# EAGLE design working (EAGLE 9.5.1)
AUTHOR: siddacious
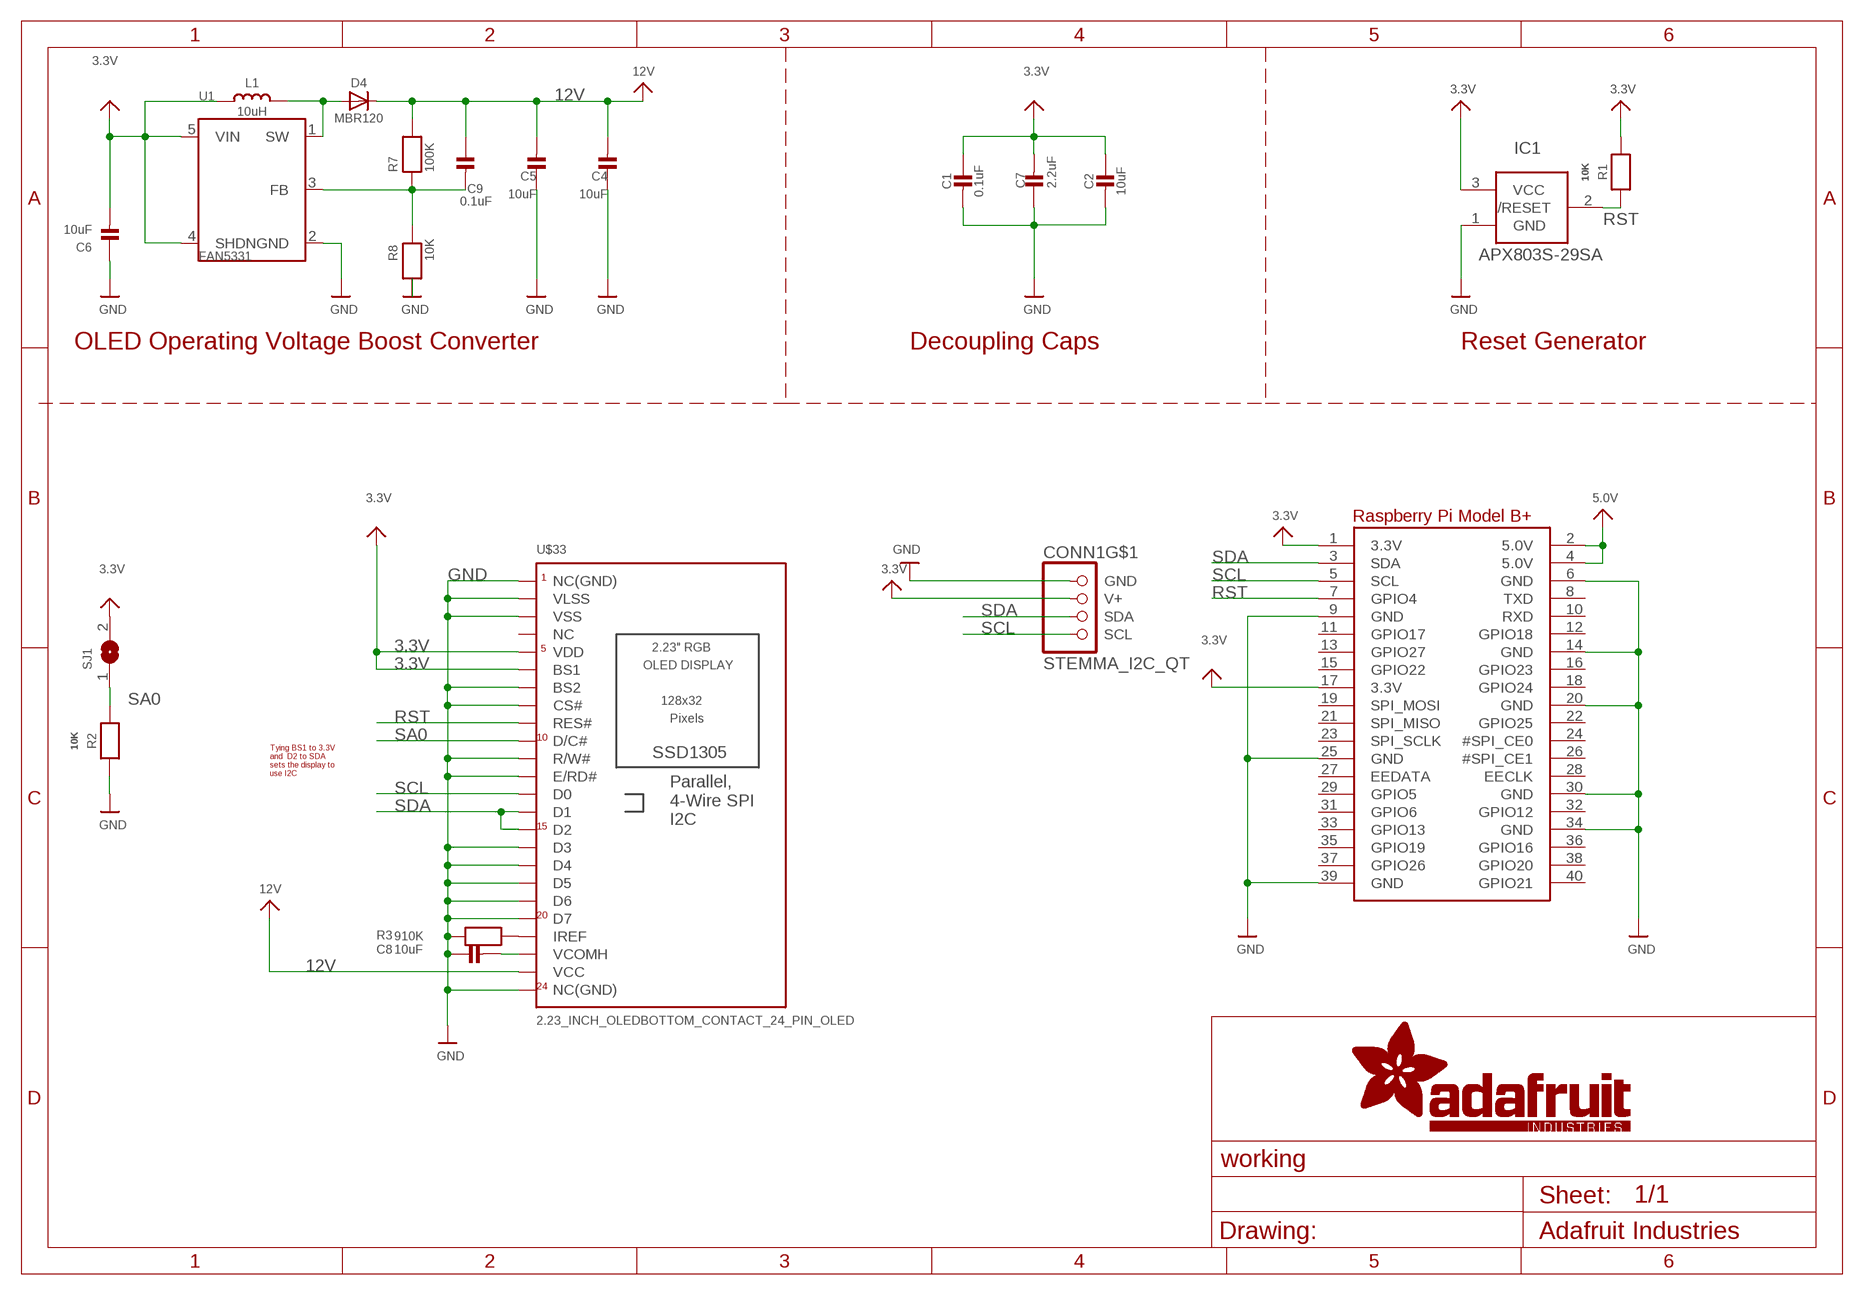
[diagram p0: schematic, sheet 1]

## Parts
C1  0.1uF  CAP_CERAMIC0603_NO  [0603-NO]
C2  10uF  CAP_CERAMIC0805-NOOUTLINE  [0805-NO]
C4  10uF  CAP_CERAMIC0805-NOOUTLINE  [0805-NO]
C5  10uF  CAP_CERAMIC0805-NOOUTLINE  [0805-NO]
C6  10uF  CAP_CERAMIC0805-NOOUTLINE  [0805-NO]
C7  2.2uF  CAP_CERAMIC0805-NOOUTLINE  [0805-NO]
C8  10uF  CAP_CERAMIC0805-NOOUTLINE  [0805-NO]
C9  0.1uF  CAP_CERAMIC0603_NO  [0603-NO]
CONN1  STEMMA_I2C_QT  [JST_SH4]
D4  MBR120  DIODESOD-123  [SOD-123]
IC1  APX803S-29SA  AXP083-SAG  [SOT23]
L1  10uH  INDUCTOR  [INDUCTOR_1007]
R1  10K  RESISTOR_0603_NOOUT  [0603-NO]
R2  10K  RESISTOR_0603_NOOUT  [0603-NO]
R3  910K  RESISTOR0805_NOOUTLINE  [0805-NO]
R7  100K  RESISTOR_0603_NOOUT  [0603-NO]
R8  10K  RESISTOR_0603_NOOUT  [0603-NO]
RPI1  RASPBERRYPI_BPLUS_BONNETSMT  [PI_BONNET_SMT]
SJ1  SOLDERJUMPER  [SOLDERJUMPER_ARROW_NOPASTE]
U1  FAN5331  VREG_FAN5331  [SOT23-5]
U$33  2.23_INCH_OLEDBOTTOM_CONTACT_24_PIN_OLED  [2.23OLED_BOTTOM_CONTACT]

## Nets
3.3V: C1.1 C2.1 C6.2 C7.2 CONN1.2(V+) IC1.3(VCC) L1.P$1 R1.2 RPI1.1(3.3V) RPI1.17(3.3V) SJ1.2 U1.4(SHDN) U1.5(VIN) U$33.5(VDD) U$33.6(BS1) ; supply symbol labelled VIN
5.0V: RPI1.2(5.0V) RPI1.4(5.0V)
12V: C4.2 C5.2 C9.1 D4.C R7.2 U$33.23(VCC)
GND: C1.2 C2.2 C4.1 C5.1 C6.1 C7.1 C8.1 CONN1.1(GND) IC1.1(GND) R2.1 R3.1 R8.1 RPI1.6(GND) RPI1.9(GND) RPI1.14(GND) RPI1.20(GND) RPI1.25(GND) RPI1.30(GND) RPI1.34(GND) RPI1.39(GND) U1.2(GND) U$33.1(NC(GND)) U$33.2(VLSS) U$33.3(VSS) U$33.7(BS2) U$33.8(CS#) U$33.11(R/W#) U$33.12(E/RD#) U$33.16(D3) U$33.17(D4) U$33.18(D5) U$33.19(D6) U$33.20(D7) U$33.24(NC(GND)) U$33.SPRT1(NC(GND)) U$33.SPRT2(NC(GND))
N$2: R3.2 U$33.21(IREF)
N$5: D4.A L1.P$2 U1.1(SW)
N$8: C9.2 R7.1 R8.2 U1.3(FB)
N$12: C8.2 U$33.22(VCOMH)
RST: IC1.2(/RESET) R1.1 RPI1.7(GPIO4) U$33.9(RES#)
SA0: R2.2 SJ1.1 U$33.10(D/C#)
SCL: CONN1.4(SCL) RPI1.5(SCL) U$33.13(D0)
SDA: CONN1.3(SDA) RPI1.3(SDA) U$33.14(D1) U$33.15(D2)
Unconnected: CONN1.MT1(MT) CONN1.MT2(MT) RPI1.8(TXD) RPI1.10(RXD) RPI1.11(GPIO17) RPI1.12(GPIO18) RPI1.13(GPIO27) RPI1.15(GPIO22) RPI1.16(GPIO23) RPI1.18(GPIO24) RPI1.19(SPI_MOSI) RPI1.21(SPI_MISO) RPI1.22(GPIO25) RPI1.23(SPI_SCLK) RPI1.24(#SPI_CE0) RPI1.26(#SPI_CE1) RPI1.27(EEDATA) RPI1.28(EECLK) RPI1.29(GPIO5) RPI1.31(GPIO6) RPI1.32(GPIO12) RPI1.33(GPIO13) RPI1.35(GPIO19) RPI1.36(GPIO16) RPI1.37(GPIO26) RPI1.38(GPIO20) RPI1.40(GPIO21) U$33.4(NC)

## Notes on the sheet
- OLED Operating Voltage Boost Converter | Decoupling Caps | Reset Generator
- Tying BS1 to 3.3V
  and  D2 to SDA
  sets the display to
  use I2C

## Library data of the parts
C1 C2 C4-C9 = microbuilder:CAP_CERAMIC: Ceramic Capacitors For new designs, use the packages preceded by an '_' character since they are more reliable: The following footprints should be used on most boards: _0402 - Standard footprint for regular board layouts _0603 - Standard footprint for regular board layouts _0805 - Standard footprint for regular board layouts _1206 - Standard footprint for regular board layouts For extremely tight-pitch boards where space is at a premium, the following 'micro-pitch' footprints can be used (smaller pads, no silkscreen outline, etc.): _0402MP - Micro-pitch footprint for very dense/compact boards _0603MP - Micro-pitch footprint for very dense/compact boards _0805MP - Micro-pitch footprint for very dense/compact boards _1206MP - Micro-pitch footprint for very dense/compact boards
CONN1 = microbuilder:STEMMA_I2C
D4 = microbuilder:DIODE: Diode SMA Model Volts Amps Type Vf Ir Digikey # Notes SSA34-E3 40V 3A Schottky 480mV @ 3A 200uA @ 40V SSA34-E3/61TGITR-ND CDBA120-G 20V 1A Schottky 500mV @ 1A 500uA @ 20V 641-1014-6-ND REEL MBRA210 10V 2A Schottky 350mV @ 2A 700uA @ 10V MBRA210LT3 SOD-123 Model Volts Amps Type Vf Ir Order # Notes BAT54T1G 30V 200mA Schottky 800mV @ 200mA 2uA @ 25V BAT54T1GOSTR-ND B0530W 30V 500mA Schottky 430mV @ 500mA 130uA @ 30V B0530W-FDICT-ND REEL MBR120 20V 1A Schottky 340mV @ 1A MBR120VLSFT1GOSCT-ND SOD-323 Model Volts Amps Type Vf Ir Order # Notes PMEG2005EJ 20V 500mA Schottky 355mV @ 500mA 568-4110-1-ND ZLLS410 10V 570mA Schottky 380mV @ 570mA ZLLS410CT-ND 1N4148WS 75V 150mA Silicon/Simple 1V 1N4148WSFSCT-ND REEL SOD-523 Model Volts Amps Type Vf Ir Order # Notes BAT54XV2 30V 200mA Schottky 0.8V @ 100mA BAT54XV2CT-ND TB751S 30V 30mA Schottky RB751S-40TE61CT-ND SOT23-R/W (R = Solder Paste/Reflow Ovens, W = Hand-Soldering) Model Volts Amps Type Vf Ir Order # Notes BAT54FILM 40V 300mA Schottky 497-7162-1-ND POWERDI-5 Model Volts Amps Type Vf Ir Order # Notes PDS560 60V 5A Schottky 670mV @ 5A 150uA @ 60V PDS560DICT-ND
IC1 = adafruit:AXP083
L1 = microbuilder:INDUCTOR: Inductors 0603: 10nH Ceramic Inductor - microwire antenna/RF (Digikey: 712-1434-2-ND) 0805: 560nH Ceramic Inductor - RF (Digikey: 553-1047-1-ND) 270nH Ceramic Inductor - Q = 40@250MHz, +-5%, 1 Ohm DC Resistance (Digikey: 535-10506-2-ND) 1007 (2518 Metric) SMT: 10µH 10% 250mOhm 820mA 1007 Inductor (Digikey: 587-2189-1-ND) 22µH 10% 500mOhm 580mA 1007 Inductor (Digikey: 587-2190-1-ND) 47µH 10% 950mOhm 420mA 1007 Inductor (Digikey: 587-2191-1-ND) 47µH 5% 100mOhm 1A 1008 Inductor (Digikey: 732-1816-1-ND) 5.0x5.0mm (Taiyo Yuden NR5040 Series) 6.8µH 20% 2.3A 64mOhm Inductor (Digikey: 587-2374-2-ND) 5.0x5.0mm (TDK VLC5045 Series) 4.7µH 20% 3.3A 34mOhm Inductor (Digikey: 445-6526-1-ND) 6.8µH 20% 2.7A 46mOhm Inductor (Digikey: 445-6527-1-ND) 6.0x6.0mm (TDK VLC6045 Series) 4.7µH 20% 3.8A 27mOhm Inductor (Digikey: 445-6538-2-ND) 6.8µH 20% 3A 41mOhm Inductor (Digikey: 445-6540-1-ND) 6.2µH 30% 2.2A 45mOhm Inductor (Digikey: SRR5028-6R2YCT-ND) - Not TDK VLC6045 but footprint should match 6.0x6.0mm (TDK SLF6045 Series) 6.8uH 30% 2A 33mOhm Inductor (Digikey: 445-4572-1-ND, Mouser: 810-SLF645T6R8N2R0PF) 6.0x6.0mm (Sumida CDRH5D28 Series) 6.2uH 30% 1.8A 45mOhm Inductor (Digikey: 308-1542-1-ND) Taiyo Yuden NR3015T2R2M - 2.2uH 20% 1.5A (Digikey: 587-1648-2-ND, Mouser: 963-NR3015T2R2M) - Used with TI TPS62172 CoilCraft RFID Transponder Coil - MA5532-AE (For use with AS3935 Lightning Sensor) Taiyo Yuden NRH2412T2R2MNGH - 2.2uH 20% 1AA (Digikey: 587-3443-1-ND) - Used with TI LM3671 Vishay IHLP 1.0uH Molded Inductor - 24mOhm DCR, 5A, +/-20%, -55°C-125°C (Digikey: 541-1319-1-ND)
R1-R3 R7 R8 = microbuilder:RESISTOR: Resistors For new designs, use the packages preceded by an '_' character since they are more reliable: The following footprints should be used on most boards: _0402 - Standard footprint for regular board layouts _0603 - Standard footprint for regular board layouts _0805 - Standard footprint for regular board layouts _1206 - Standard footprint for regular board layouts For extremely tight-pitch boards where space is at a premium, the following 'micro-pitch' footprints can be used (smaller pads, no silkscreen outline, etc.): _0402MP - Micro-pitch footprint for very dense/compact boards _0603MP - Micro-pitch footprint for very dense/compact boards _0805MP - Micro-pitch footprint for very dense/compact boards _1206MP - Micro-pitch footprint for very dense/compact boards
RPI1 = adafruit_sbc:RASPBERRYPI_BPLUS
SJ1 = microbuilder:SOLDERJUMPER: SMD Solder JUMPER Solder the two pads together to create a connection, or remove the solder to break it. REFLOW - Use this footprint for solder paste and reflow ovens. WAVE - Use this footprint for hand-soldering (larger pads). CLOSED - Has a trace between the two pads to ensure it is closed by default. The trace needs to be cut to disable the jumper, and can be closed again by creating a solder bridge between the two pads.; BOM: EXCLUDE
U1 = microbuilder:VREG_FAN5331: FAN5331 - LED/OLED 20V Boost Converter Digikey: FAN5331SXCT-ND
U$33 = microbuilder:2.23_INCH_OLED

## Board
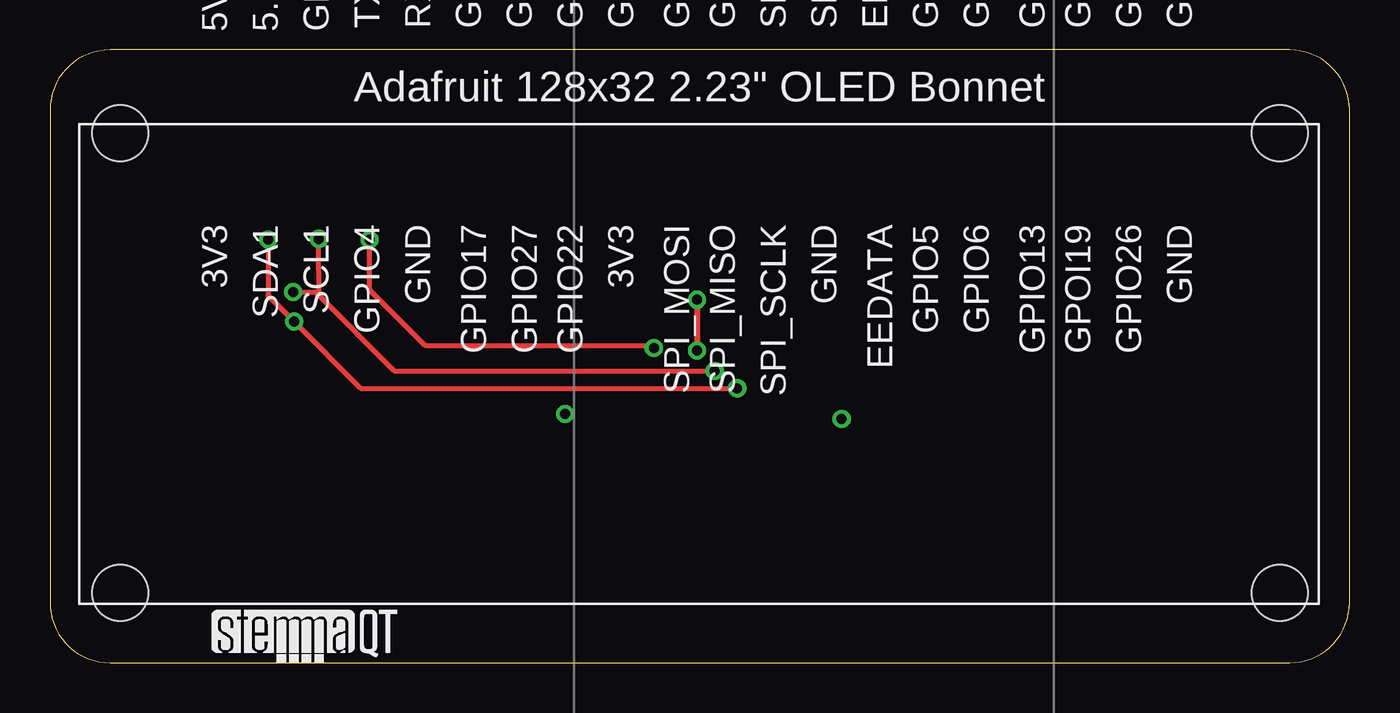
[diagram p1: board, top side]
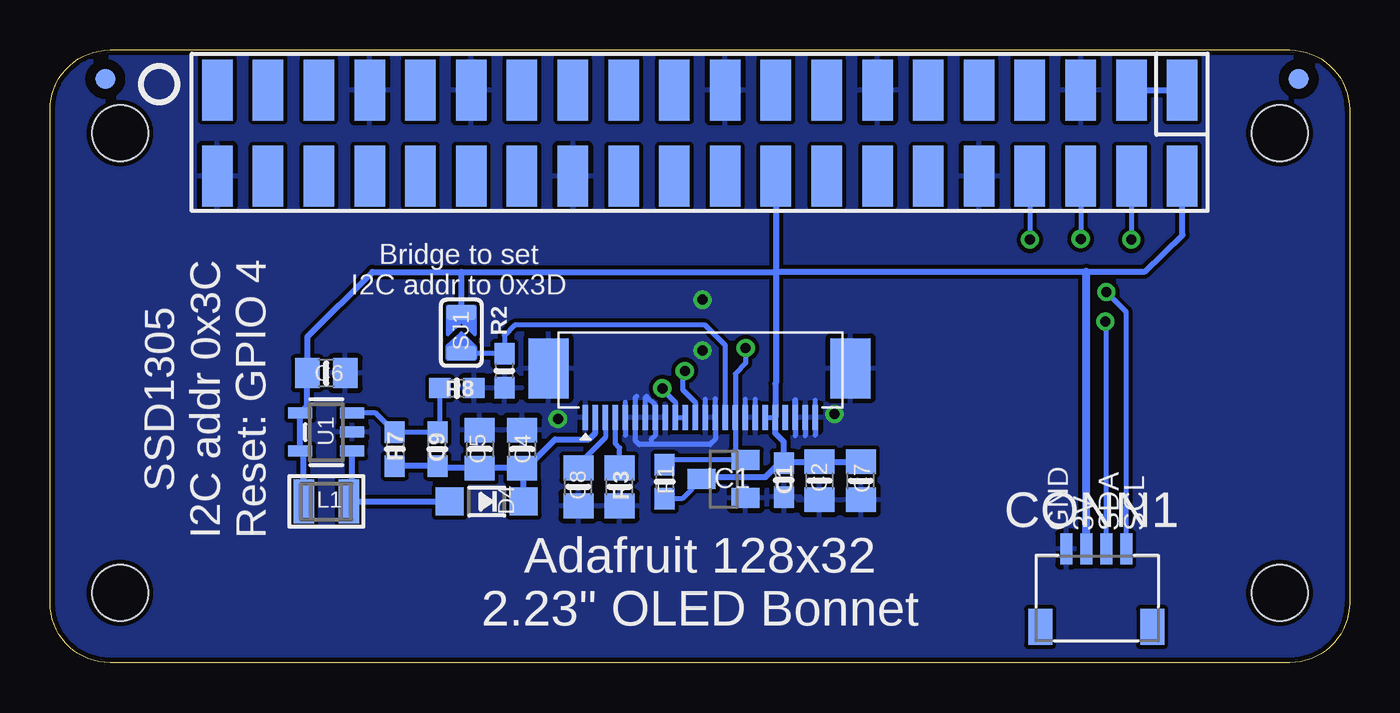
[diagram p2: board, bottom side, seen from below]

Size 65 x 30.66 mm. Coordinates in mm from the lower left corner, seen from the top.
Copper layers (1*16): Top 0.035mm / dielectric 1.5mm / Bottom 0.035mm
Design rules "adafruit": minimum track width 8mil, minimum drill 15.5mil, track to track 8mil, track to pad 8mil, pad to pad 8mil, via to via 8mil, smd to smd 8mil, copper to edge 10mil, drill to drill 8mil, minimum pad ring 10mil, minimum via ring 8mil, stop-mask expansion 2mil, vias tented up to drill 20mil, thermal gap 10mil

### Footprints (pad centres in the part's own frame; a part is rotated, then mirrored left to right if it is on the bottom)
0603-NO = smd 1.075 x 1: 1 -0.85,0; 2 0.85,0
0805-NO = smd 1.24 x 1.5: 1 -0.95,0; 2 0.95,0
JST_SH4 = smd 0.6 x 1.55: 1 -1.5,2.514; 2 -0.5,2.514; 3 0.5,2.514; 4 1.5,2.514 | smd 1.2 x 1.8: MT1 -2.8,-1.386; MT2 2.8,-1.386
SOD-123 = smd 1.4 x 1.4: A 1.85,0; C -1.85,0
SOT23 = smd 1 x 1.4: 1 -0.95,-1.1; 2 0.95,-1.1; 3 0,1.1
INDUCTOR_1007 = smd 1.016 x 2.2: P$1 -1.127,0; P$2 1.127,0
PI_BONNET_SMT = smd 1.524 x 3.048 bottom: 1 8.37,24.339; 2 8.37,28.657; 3 10.91,24.339; 4 10.91,28.657; 5 13.45,24.339; 6 13.45,28.657; 7 15.99,24.339; 8 15.99,28.657; 9 18.53,24.339; 10 18.53,28.657; 11 21.07,24.339; 12 21.07,28.657; 13 23.61,24.339; 14 23.61,28.657; 15 26.15,24.339; 16 26.15,28.657; 17 28.69,24.339; 18 28.69,28.657; 19 31.23,24.339; 20 31.23,28.657; 21 33.77,24.339; 22 33.77,28.657; 23 36.31,24.339; 24 36.31,28.657; 25 38.85,24.339; 26 38.85,28.657; 27 41.39,24.339; 28 41.39,28.657; 29 43.93,24.339; 30 43.93,28.657; 31 46.47,24.339; 32 46.47,28.657; 33 49.01,24.339; 34 49.01,28.657; 35 51.55,24.339; 36 51.55,28.657; 37 54.09,24.339; 38 54.09,28.657; 39 56.63,24.339; 40 56.63,28.657 | smd 1 x 1 bottom: 41 2.54,29.21; 42 62.23,29.21 | hole 2.8: 3.5,3.5; 3.5,26.5; 61.5,26.5; 61.5,3.5
SOLDERJUMPER_ARROW_NOPASTE = smd 0.762 x 1.524: 1 -1.016,0; 2 1.016,0
SOT23-5 = smd 0.55 x 1.2: 1 -0.95,-1.3; 2 0,-1.3; 3 0.95,-1.3; 4 0.95,1.3; 5 -0.95,1.3
2.23OLED_BOTTOM_CONTACT = smd 0.275 x 1.25 bottom: 1 -5.755,-2.484; 2 -5.255,-2.484; 3 -4.755,-2.484; 4 -4.255,-2.484; 5 -3.755,-2.484; 6 -3.255,-2.484; 7 -2.755,-2.484; 8 -2.255,-2.484; 9 -1.755,-2.484; 10 -1.255,-2.484; 11 -0.755,-2.484; 12 -0.255,-2.484; 13 0.245,-2.484; 14 0.745,-2.484; 15 1.245,-2.484; 16 1.745,-2.484; 17 2.245,-2.484; 18 2.745,-2.484; 19 3.245,-2.484; 20 3.745,-2.484; 21 4.245,-2.484; 22 4.745,-2.484; 23 5.245,-2.484; 24 5.745,-2.484 | smd 2 x 3 bottom: SPRT1 7.595,-0.024; SPRT2 -7.515,-0.024

### Placement (x,y rotation side)
C1  28.3,9.14 270 bottom
C2  26.52,9.11 270 bottom
C4  41.39,10.69 270 bottom
C5  43.5,10.69 270 bottom
C6  51.18,14.49 180 bottom
C7  24.45,9.11 90 bottom
C8  38.57,8.8 90 bottom
C9  45.62,10.69 90 bottom
CONN1  12.67,3.17 0 bottom
D4  43.16,8.07 180 bottom
IC1  31.31,9.19 90 bottom
L1  51.18,8.07 0 bottom
R1  34.26,9.05 270 bottom
R2  42.27,14.61 90 bottom
R3  36.51,8.8 90 bottom
R7  47.75,10.69 270 bottom
R8  44.64,13.74 180 bottom
RPI1  0,0 0 top
SJ1  44.42,16.51 90 bottom
U1  51.18,11.54 90 bottom
U$2  [PCBFEAT-REV-040]  59.54,28.96 0 bottom
U$11  [STEMMAQT]  8.1,0 0 top
U$33  32.47,14.75 0 top

### Tracks (layer width: path | path; a pad name or v marks a point on that pad's centre or on a via)
3.3V
  Bottom 0.254: U$33.6 U$33.5 | IC1.3 33.39,8.21 R1.2
  Bottom 0.305: L1.P$1 52.31,10.41 U1.5 U1.4 52.13,12.84 C6.2 52.13,16.3 48.87,19.56 44.42,19.56 | RPI1.1 8.36,24.33 8.36,21.4 10.27,19.56 13.17,19.56 28.69,19.56 | 44.42,19.56 28.69,19.56 | RPI1.17 28.69,19.56 | 28.69,19.56 28.69,14 28.72,13.97 U$33.5 28.72,11.47 28.3,11.05 C1.1 | C1.1 28.23,10.06 C2.1 C7.2 | C1.1 28.52,9.99 29.23,9.28 32.31,9.28 IC1.3 | SJ1.2 44.42,19.56
  Bottom 0.406: CONN1.2 13.17,19.38 13.17,19.56
5.0V
  Bottom 0.305: RPI1.4 RPI1.2 | RPI1.4 | RPI1.4 | RPI1.2 | RPI1.2
12V
  Bottom 0.305: D4.C 41.31,9.66 C4.2 | C4.2 C5.2 45.52,9.74 C9.1 R7.2 | C4.2 41.17,9.74 39.73,11.18 38.05,11.18 37.72,11.5 U$33.23
GND  (via drill 0.5)
  Top 0.305: v32.36,18.16 v32.36,15.62
  Bottom 0.254: 36.22,13.03 U$33.20 36.22,11.38 | 35.66,13.34 35.72,13.28 U$33.19 35.72,11.11 35.53,10.92 31.98,10.92 31.72,11.18 U$33.11 31.72,13.2 | U$33.18 35.22,13.27 35.15,13.34 34.72,12.9 U$33.17 34.72,11.38 34.93,11.17 34.93,11.05 | U$33.12 32.22,13.2 | U$33.8 30.22,13.19 | U$33.7 29.72,13.18 | 26.72,13.13 U$33.1 26.72,11.38 | U$33.3 27.72,11.36 | U$33.2 27.22,11.37
  Bottom 0.305: U$33.3 27.72,13.14
  other vias: 25.76,12.45 39.6,12.19
  pour Bottom: -0.03,30.61 -0.03,0 65.25,0 65.25,30.61
N$2
  Bottom 0.254: R3.2 36.51,10.76 36.72,10.96 U$33.21
N$5
  Bottom 0.305: D4.A L1.P$2 49.88,8.24 U1.1
N$8
  Bottom 0.254: U1.3 48.7,12.49 R7.1 C9.2 45.49,11.67 R8.2
N$12
  Bottom 0.254: U$33.22 37.22,11.27 38.57,9.92 C8.2
RST  (via drill 0.5)
  Top 0.254: v30.2,15.75 30.07,15.88 18.77,15.88 15.99,18.66 v15.99,21.16 | v15.99,21.16
  Bottom 0.254: v30.2,15.75 30.2,14.99 30.72,14.47 U$33.9 30.72,10.65 IC1.2 34.03,10.14 R1.1 | RPI1.7 v15.99,21.16
SA0
  Bottom 0.254: U$33.10 31.22,15.88 32.23,16.89 41.76,16.89 42.27,16.38 42.27,15.49 | 42.27,15.49 R2.2 | SJ1.1 42.27,15.49
SCL  (via drill 0.5)
  Top 0.254: v33.25,14.61 17.22,14.61 13.45,18.37 | 13.45,18.37 13.45,20.83 | 13.45,20.83 | v13.45,21.21 13.45,20.83 | v12.17,18.54 13.28,18.54 13.45,18.37
  Bottom 0.254: v33.25,14.61 33.35,14.5 33.35,13.66 32.72,13.03 U$33.13 | RPI1.5 v13.45,21.21 | v13.45,21.21 | CONN1.4 11.17,17.55 v12.17,18.54
SDA  (via drill 0.5)
  Top 0.254: v34.37,13.73 15.55,13.73 v12.22,17.07 10.91,18.37 v10.91,21.16
  Bottom 0.254: v34.37,13.73 34.37,13.69 33.72,13.03 U$33.15 U$33.14 | RPI1.3 v10.91,21.16 | CONN1.3 12.17,17.03 v12.22,17.07

### Text on the board
tPlace: Adafruit 128x32 2.23" OLED Bonnet
bPlace: Bridge to set / I2C addr to 0x3D | SSD1305 / I2C addr 0x3C / Reset: GPIO 4 | SCL | SDA | 3V | GND | Adafruit 128x32 / 2.23" OLED Bonnet